# Altium schematic sheet altium_sample_lf.SchDoc
size A4
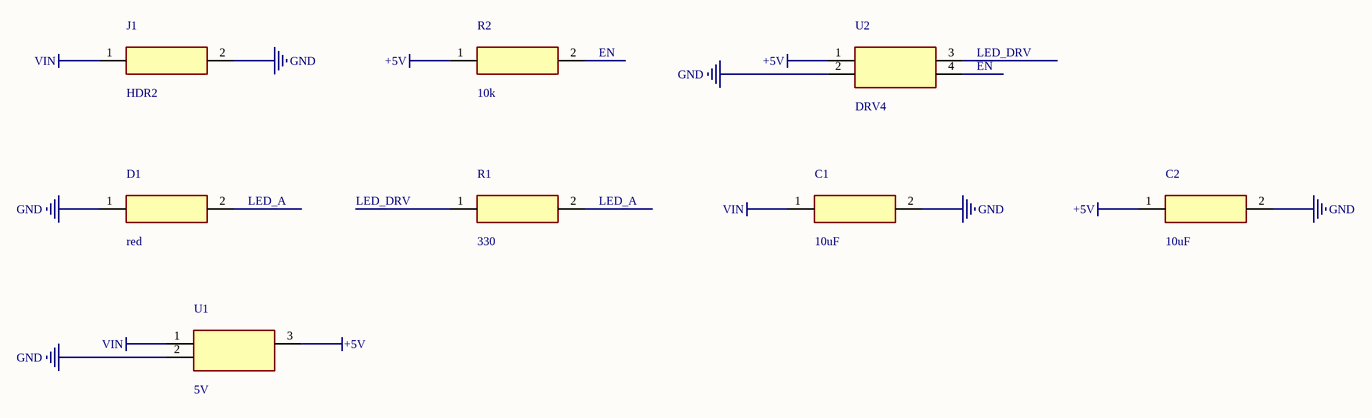
[diagram p0: altium_sample_lf.SchDoc]

## Parts
C1  10uF  [C0603]
C2  10uF  [C0603]
D1  red  [LED0603]
J1  HDR2  [HDR1X2]
R1  330  [R0603]
R2  10k  [R0603]
U1  5V  [SOT23]
U2  DRV4  [SOT143]

## Nets
+5V: C2.1 R2.1 U1.3 U2.1
GND: C1.2 C2.2 D1.1 J1.2 U1.2 U2.2
VIN: C1.1 J1.1 U1.1
EN: R2.2 U2.4
LED_A: D1.2 R1.2
LED_DRV: R1.1 U2.3

## Library data of the parts
C1 C2 = CAP
D1 = LED
R1 R2 = RES
U1 = LDO3